# Altium schematic sheet Key.SchDoc
size 127 x 127 mm
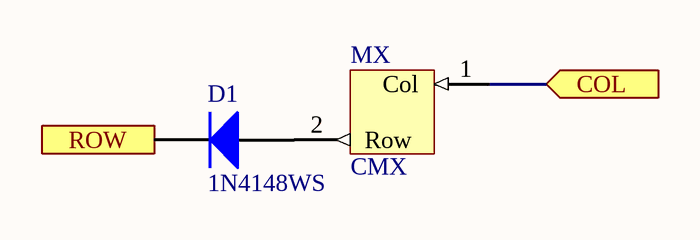
[diagram p0: Key.SchDoc]

## Parts
D1  1N4148WS  [DIOD-SOD323-2-A_V]
MX  CMX  [MX]

## Ports
COL (in), ROW (out)

## Nets
COL: MX.1(Col) ; port COL
ROW: D1.2(K) ; port ROW
NetD1_1: D1.1(A) MX.2(Row)

## Library data of the parts
D1 = CMP-1667-00004-1: Fast Switching Diode, 75 V, 0.3 A, -65 to 150 degC, 2-Pin SOD323, RoHS, Tape and Reel; DatasheetVersion: Rev. 25-2, 03/2016; PackageDescription: 2-Pin Small Outline Diode, Body 1.7 x 1.3 mm; ComponentLink2Description: Datasheet; ComponentLink1URL: http://www.diodes.com/; PackageReference: SOD323-2; ComponentLink2URL: http://www.diodes.com/datasheets/ds30097.pdf; ComponentLink1Description: Manufacturer URL
MX = MX: Cherry MX Footprint